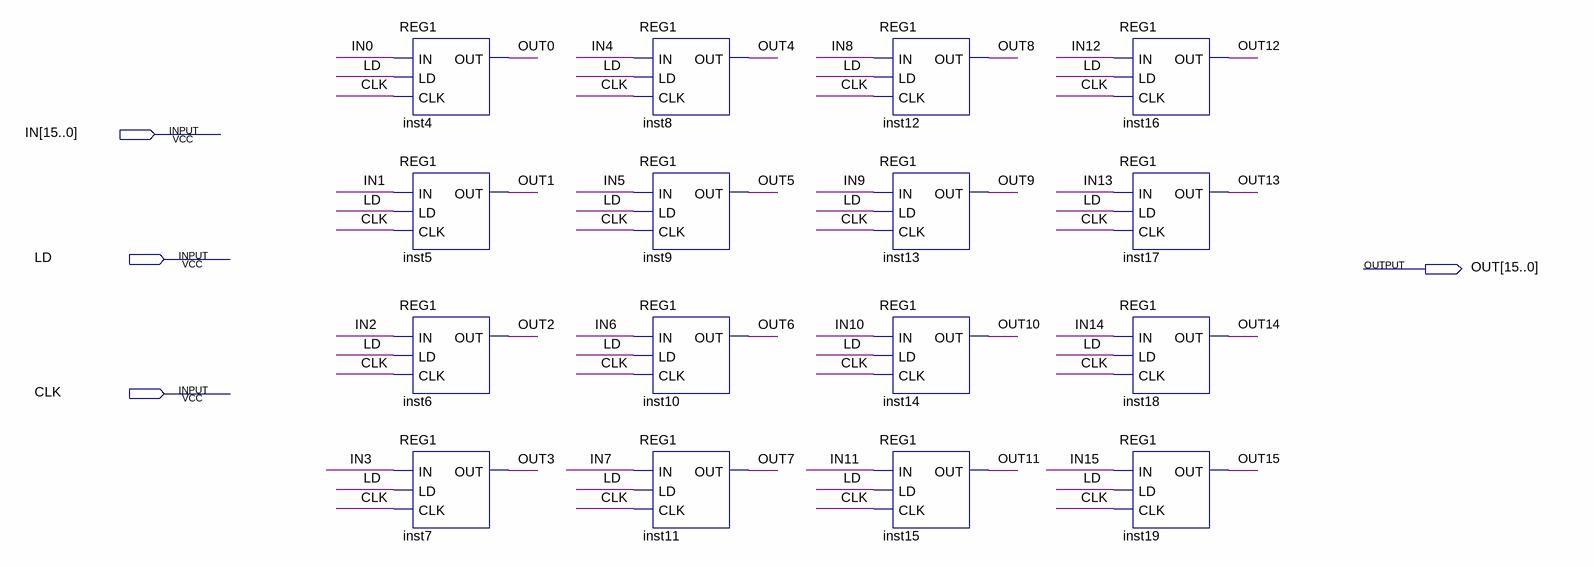
[diagram p0: schematic sheet]
// Quartus schematic REG16.bdf as structural Verilog: 16 symbols, 4 pins
module REG16 (
  input  [15:0] IN,
  input  LD,
  input  CLK,
  output [15:0] OUT
);

  REG1 inst4 (.IN(IN[0]), .LD(LD), .CLK(CLK), .OUT(OUT[0]));
  REG1 inst5 (.IN(IN[1]), .LD(LD), .CLK(CLK), .OUT(OUT[1]));
  REG1 inst6 (.IN(IN[2]), .LD(LD), .CLK(CLK), .OUT(OUT[2]));
  REG1 inst7 (.IN(IN[3]), .LD(LD), .CLK(CLK), .OUT(OUT[3]));
  REG1 inst8 (.IN(IN[4]), .LD(LD), .CLK(CLK), .OUT(OUT[4]));
  REG1 inst9 (.IN(IN[5]), .LD(LD), .CLK(CLK), .OUT(OUT[5]));
  REG1 inst10 (.IN(IN[6]), .LD(LD), .CLK(CLK), .OUT(OUT[6]));
  REG1 inst11 (.IN(IN[7]), .LD(LD), .CLK(CLK), .OUT(OUT[7]));
  REG1 inst12 (.IN(IN[8]), .LD(LD), .CLK(CLK), .OUT(OUT[8]));
  REG1 inst13 (.IN(IN[9]), .LD(LD), .CLK(CLK), .OUT(OUT[9]));
  REG1 inst14 (.IN(IN[10]), .LD(LD), .CLK(CLK), .OUT(OUT[10]));
  REG1 inst15 (.IN(IN[11]), .LD(LD), .CLK(CLK), .OUT(OUT[11]));
  REG1 inst16 (.IN(IN[12]), .LD(LD), .CLK(CLK), .OUT(OUT[12]));
  REG1 inst17 (.IN(IN[13]), .LD(LD), .CLK(CLK), .OUT(OUT[13]));
  REG1 inst18 (.IN(IN[14]), .LD(LD), .CLK(CLK), .OUT(OUT[14]));
  REG1 inst19 (.IN(IN[15]), .LD(LD), .CLK(CLK), .OUT(OUT[15]));
endmodule
